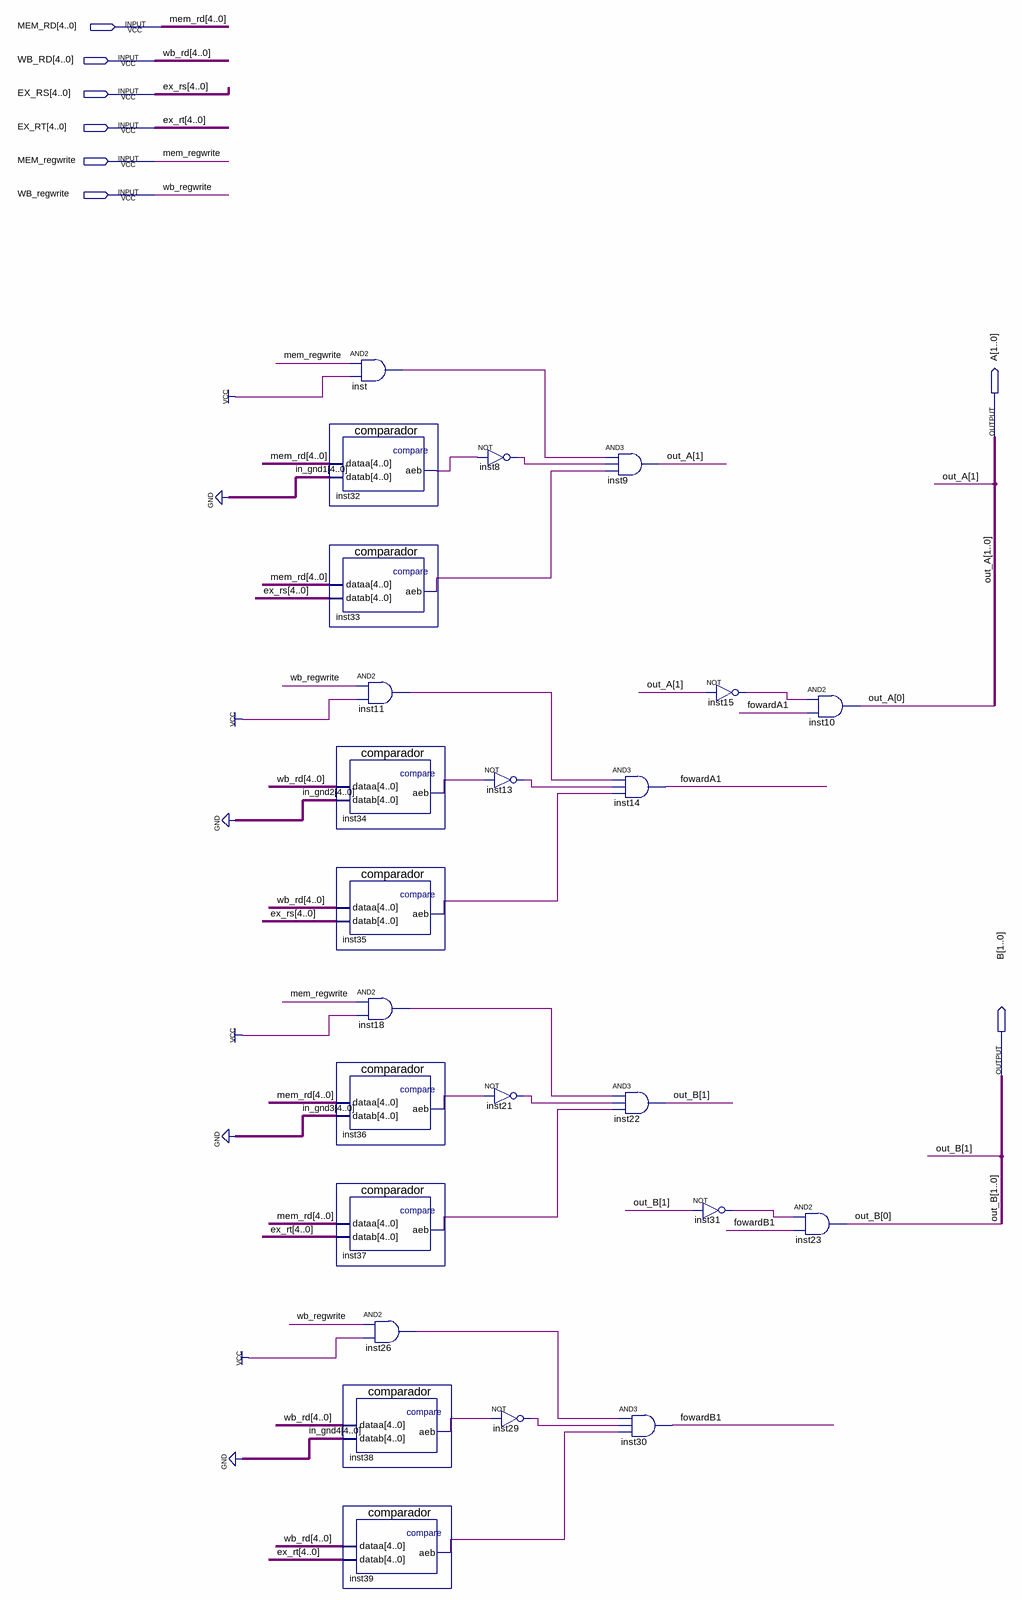
[diagram p0: schematic sheet]
// Quartus schematic forwarding_unit.bdf as structural Verilog: 24 symbols, 8 pins
module forwarding_unit (
  input  [4:0] MEM_RD,
  input  [4:0] WB_RD,
  input  [4:0] EX_RS,
  input  [4:0] EX_RT,
  input  MEM_regwrite,
  input  WB_regwrite,
  output [1:0] A,
  output [1:0] B
);

  wire fowardA1, fowardB1, inst8_out, inst11_out, inst13_out, inst15_out, inst18_out, inst21_out, inst26_out,
       inst29_out, inst31_out, inst32_aeb, inst33_aeb, inst34_aeb, inst35_aeb, inst36_aeb, inst37_aeb,
       inst38_aeb, inst39_aeb, inst_out;

  comparador inst32 (.dataa(MEM_RD), .datab({5{1'b0}}), .aeb(inst32_aeb));
  comparador inst33 (.dataa(MEM_RD), .datab(EX_RS), .aeb(inst33_aeb));
  comparador inst34 (.dataa(WB_RD), .datab({5{1'b0}}), .aeb(inst34_aeb));
  comparador inst35 (.dataa(WB_RD), .datab(EX_RS), .aeb(inst35_aeb));
  comparador inst36 (.dataa(MEM_RD), .datab({5{1'b0}}), .aeb(inst36_aeb));
  comparador inst37 (.dataa(MEM_RD), .datab(EX_RT), .aeb(inst37_aeb));
  comparador inst38 (.dataa(WB_RD), .datab({5{1'b0}}), .aeb(inst38_aeb));
  comparador inst39 (.dataa(WB_RD), .datab(EX_RT), .aeb(inst39_aeb));
  and inst (inst_out, MEM_regwrite, 1'b1);
  and inst11 (inst11_out, WB_regwrite, 1'b1);
  and inst18 (inst18_out, MEM_regwrite, 1'b1);
  and inst26 (inst26_out, WB_regwrite, 1'b1);
  not inst8 (inst8_out, inst32_aeb);
  not inst13 (inst13_out, inst34_aeb);
  not inst21 (inst21_out, inst36_aeb);
  not inst29 (inst29_out, inst38_aeb);
  and inst9 (A[1], inst_out, inst8_out, inst33_aeb);
  and inst14 (fowardA1, inst11_out, inst13_out, inst35_aeb);
  and inst22 (B[1], inst18_out, inst21_out, inst37_aeb);
  and inst30 (fowardB1, inst26_out, inst29_out, inst39_aeb);
  not inst15 (inst15_out, A[1]);
  not inst31 (inst31_out, B[1]);
  and inst10 (A[0], inst15_out, fowardA1);
  and inst23 (B[0], inst31_out, fowardB1);

  // Other names for the same wires on the sheet: out_A[1:0] = A; out_B[1:0] = B
endmodule
